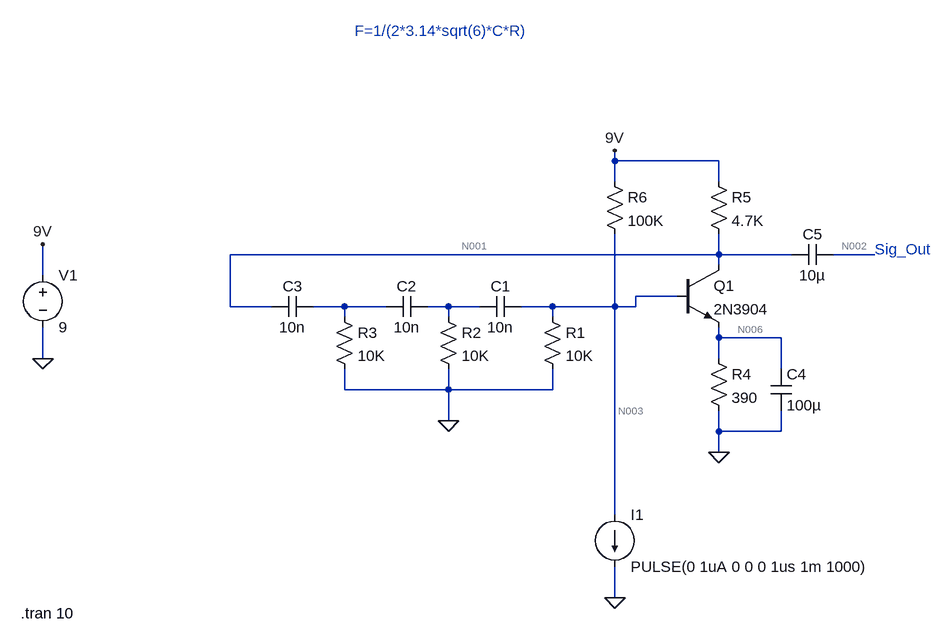
[diagram p0: schematic phase_shift_oscillator_bjt.asc]
phase_shift_oscillator_bjt.asc, the LTspice schematic file:
Version 4
SHEET 1 880 680
WIRE 48 -48 48 -64
WIRE 208 -48 48 -48
WIRE 48 -16 48 -48
WIRE 208 -16 208 -48
WIRE 208 96 208 64
WIRE 208 96 -544 96
WIRE 320 96 208 96
WIRE 448 96 384 96
WIRE 208 112 208 96
WIRE -832 128 -832 80
WIRE 144 160 80 160
WIRE -544 176 -544 96
WIRE -480 176 -544 176
WIRE -368 176 -416 176
WIRE -304 176 -368 176
WIRE -208 176 -240 176
WIRE -160 176 -208 176
WIRE -48 176 -96 176
WIRE 48 176 48 64
WIRE 48 176 -48 176
WIRE 80 176 80 160
WIRE 80 176 48 176
WIRE -368 192 -368 176
WIRE -208 192 -208 176
WIRE -48 192 -48 176
WIRE 208 224 208 208
WIRE 304 224 208 224
WIRE -832 256 -832 208
WIRE 208 256 208 224
WIRE 304 272 304 224
WIRE -368 304 -368 272
WIRE -208 304 -208 272
WIRE -208 304 -368 304
WIRE -48 304 -48 272
WIRE -48 304 -208 304
WIRE -208 352 -208 304
WIRE 208 368 208 336
WIRE 304 368 304 336
WIRE 304 368 208 368
WIRE 208 400 208 368
WIRE 48 496 48 176
WIRE 48 624 48 576
FLAG 208 400 0
FLAG -208 352 0
FLAG -832 256 0
FLAG -832 80 9V
FLAG 48 624 0
FLAG 48 -64 9V
SYMBOL npn 144 112 R0
SYMATTR InstName Q1
SYMATTR Value 2N3904
SYMBOL current 48 496 R0
WINDOW 123 0 0 Left 0
WINDOW 39 0 0 Left 0
SYMATTR InstName I1
SYMATTR Value PULSE(0 1uA 0 0 0 1us 1m 1000)
SYMBOL res -64 176 R0
SYMATTR InstName R1
SYMATTR Value 10K
SYMBOL res -224 176 R0
SYMATTR InstName R2
SYMATTR Value 10K
SYMBOL res -384 176 R0
SYMATTR InstName R3
SYMATTR Value 10K
SYMBOL cap -96 160 R90
WINDOW 0 0 32 VBottom 2
WINDOW 3 32 32 VTop 2
SYMATTR InstName C1
SYMATTR Value 10n
SYMBOL cap -240 160 R90
WINDOW 0 0 32 VBottom 2
WINDOW 3 32 32 VTop 2
SYMATTR InstName C2
SYMATTR Value 10n
SYMBOL cap -416 160 R90
WINDOW 0 0 32 VBottom 2
WINDOW 3 32 32 VTop 2
SYMATTR InstName C3
SYMATTR Value 10n
SYMBOL res 192 240 R0
SYMATTR InstName R4
SYMATTR Value 390
SYMBOL cap 288 272 R0
SYMATTR InstName C4
SYMATTR Value 100µ
SYMBOL res 192 -32 R0
SYMATTR InstName R5
SYMATTR Value 4.7K
SYMBOL res 32 -32 R0
SYMATTR InstName R6
SYMATTR Value 100K
SYMBOL voltage -832 112 R0
WINDOW 123 0 0 Left 0
WINDOW 39 0 0 Left 0
SYMATTR InstName V1
SYMATTR Value 9
SYMBOL cap 384 80 R90
WINDOW 0 0 32 VBottom 2
WINDOW 3 32 32 VTop 2
SYMATTR InstName C5
SYMATTR Value 10µ
TEXT -352 -248 Left 2 ;F=1/(2*3.14*sqrt(6)*C*R)
TEXT 448 88 Left 2 ;Sig_Out
TEXT -866 648 Left 2 !.tran 10

The netlist it stands for:
* phase_shift_oscillator_bjt.asc
Q1 N001 N003 N006 0 2N3904
I1 N003 0 PULSE(0 1uA 0 0 0 1us 1m 1000)
R1 N003 0 10K
R2 N005 0 10K
R3 N004 0 10K
C1 N003 N005 10n
C2 N005 N004 10n
C3 N004 N001 10n
R4 N006 0 390
C4 N006 0 100µ
R5 9V N001 4.7K
R6 9V N003 100K
V1 9V 0 9
C5 N002 N001 10µ
.model NPN NPN
.model PNP PNP
.lib standard.bjt
* F=1/(2*3.14*sqrt(6)*C*R)
* Sig_Out
.tran 10
.backanno
.end

* Results of the author's LTspice run, read from the files saved beside the schematic
* Operating Point, zero values left out:
*   V(n001) = 6.922 V
*   V(n003) = 805.5 mV
*   V(n006) = 173 mV
*   V(9v) = 9 V
*   V(n002) = 69.22 µV
*   Ic(Q1) = 442.1 µA
*   Ib(Q1) = 1.39 µA
*   Ie(Q1) = -443.5 µA
*   I(R6) = 81.94 µA
*   I(R5) = 442.1 µA
*   I(R4) = 443.5 µA
*   I(R1) = 80.55 µA
*   I(V1) = -524.1 µA